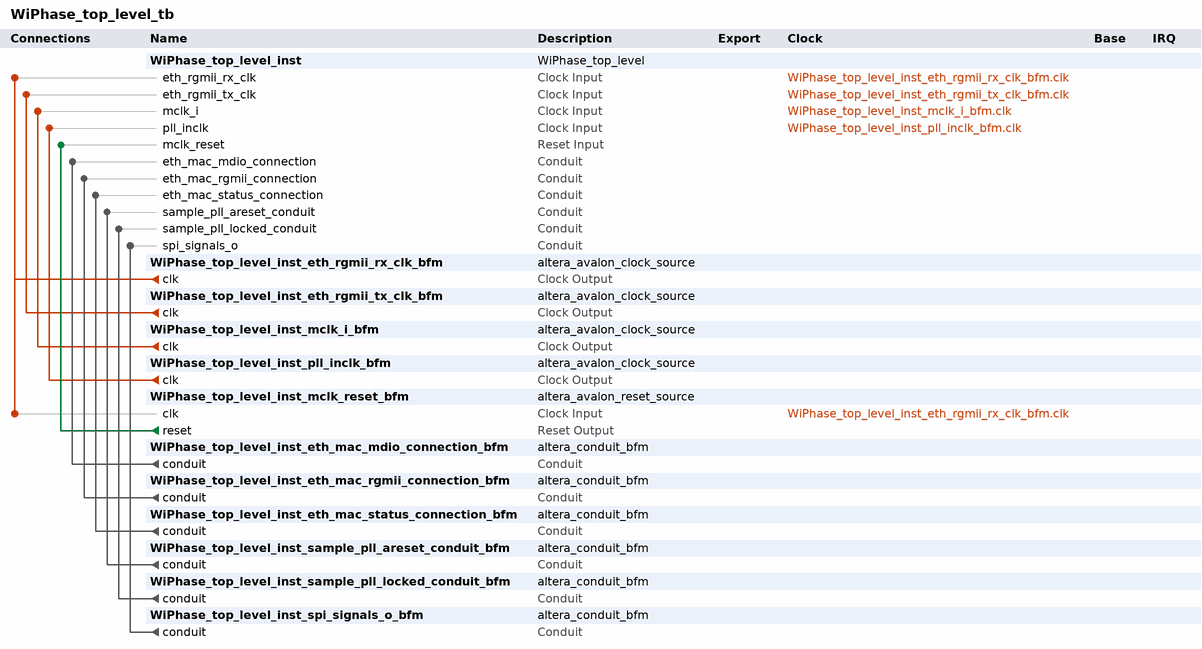
[diagram p0: system contents]
# Platform Designer (Qsys) system WiPhase_top_level_tb, Cyclone 10 LP 10CL025YU256C8G
# Parameters at their usual value, and those the tool derives, are not listed.
package require -exact qsys 17.1
create_system WiPhase_top_level_tb
set_project_property DEVICE_FAMILY {Cyclone 10 LP}
set_project_property DEVICE 10CL025YU256C8G

add_instance WiPhase_top_level_inst WiPhase_top_level 1.0

add_instance WiPhase_top_level_inst_eth_rgmii_rx_clk_bfm altera_avalon_clock_source 17.1

add_instance WiPhase_top_level_inst_eth_rgmii_tx_clk_bfm altera_avalon_clock_source 17.1

add_instance WiPhase_top_level_inst_mclk_i_bfm altera_avalon_clock_source 17.1

add_instance WiPhase_top_level_inst_pll_inclk_bfm altera_avalon_clock_source 17.1

add_instance WiPhase_top_level_inst_mclk_reset_bfm altera_avalon_reset_source 17.1
set_instance_parameter_value WiPhase_top_level_inst_mclk_reset_bfm ASSERT_HIGH_RESET 0
set_instance_parameter_value WiPhase_top_level_inst_mclk_reset_bfm INITIAL_RESET_CYCLES 50

add_instance WiPhase_top_level_inst_eth_mac_mdio_connection_bfm altera_conduit_bfm 17.1
set_instance_parameter_value WiPhase_top_level_inst_eth_mac_mdio_connection_bfm CLOCKED_SIGNAL false
set_instance_parameter_value WiPhase_top_level_inst_eth_mac_mdio_connection_bfm ENABLE_RESET false
set_instance_parameter_value WiPhase_top_level_inst_eth_mac_mdio_connection_bfm SIGNAL_DIRECTIONS input,output,input,input
set_instance_parameter_value WiPhase_top_level_inst_eth_mac_mdio_connection_bfm SIGNAL_ROLES mdc,mdio_in,mdio_oen,mdio_out
set_instance_parameter_value WiPhase_top_level_inst_eth_mac_mdio_connection_bfm SIGNAL_WIDTHS 1,1,1,1

add_instance WiPhase_top_level_inst_eth_mac_rgmii_connection_bfm altera_conduit_bfm 17.1
set_instance_parameter_value WiPhase_top_level_inst_eth_mac_rgmii_connection_bfm CLOCKED_SIGNAL false
set_instance_parameter_value WiPhase_top_level_inst_eth_mac_rgmii_connection_bfm ENABLE_RESET false
set_instance_parameter_value WiPhase_top_level_inst_eth_mac_rgmii_connection_bfm SIGNAL_DIRECTIONS output,input,output,input
set_instance_parameter_value WiPhase_top_level_inst_eth_mac_rgmii_connection_bfm SIGNAL_ROLES rgmii_in,rgmii_out,rx_control,tx_control
set_instance_parameter_value WiPhase_top_level_inst_eth_mac_rgmii_connection_bfm SIGNAL_WIDTHS 4,4,1,1

add_instance WiPhase_top_level_inst_eth_mac_status_connection_bfm altera_conduit_bfm 17.1
set_instance_parameter_value WiPhase_top_level_inst_eth_mac_status_connection_bfm CLOCKED_SIGNAL false
set_instance_parameter_value WiPhase_top_level_inst_eth_mac_status_connection_bfm ENABLE_RESET false
set_instance_parameter_value WiPhase_top_level_inst_eth_mac_status_connection_bfm SIGNAL_DIRECTIONS input,input,output,output
set_instance_parameter_value WiPhase_top_level_inst_eth_mac_status_connection_bfm SIGNAL_ROLES ena_10,eth_mode,set_10,set_1000
set_instance_parameter_value WiPhase_top_level_inst_eth_mac_status_connection_bfm SIGNAL_WIDTHS 1,1,1,1

add_instance WiPhase_top_level_inst_sample_pll_areset_conduit_bfm altera_conduit_bfm 17.1
set_instance_parameter_value WiPhase_top_level_inst_sample_pll_areset_conduit_bfm CLOCKED_SIGNAL false
set_instance_parameter_value WiPhase_top_level_inst_sample_pll_areset_conduit_bfm ENABLE_RESET false
set_instance_parameter_value WiPhase_top_level_inst_sample_pll_areset_conduit_bfm SIGNAL_DIRECTIONS output
set_instance_parameter_value WiPhase_top_level_inst_sample_pll_areset_conduit_bfm SIGNAL_WIDTHS 1

add_instance WiPhase_top_level_inst_sample_pll_locked_conduit_bfm altera_conduit_bfm 17.1
set_instance_parameter_value WiPhase_top_level_inst_sample_pll_locked_conduit_bfm CLOCKED_SIGNAL false
set_instance_parameter_value WiPhase_top_level_inst_sample_pll_locked_conduit_bfm ENABLE_RESET false
set_instance_parameter_value WiPhase_top_level_inst_sample_pll_locked_conduit_bfm SIGNAL_DIRECTIONS input
set_instance_parameter_value WiPhase_top_level_inst_sample_pll_locked_conduit_bfm SIGNAL_WIDTHS 1

add_instance WiPhase_top_level_inst_spi_signals_o_bfm altera_conduit_bfm 17.1
set_instance_parameter_value WiPhase_top_level_inst_spi_signals_o_bfm CLOCKED_SIGNAL false
set_instance_parameter_value WiPhase_top_level_inst_spi_signals_o_bfm ENABLE_RESET false
set_instance_parameter_value WiPhase_top_level_inst_spi_signals_o_bfm SIGNAL_DIRECTIONS output,input,input,input
set_instance_parameter_value WiPhase_top_level_inst_spi_signals_o_bfm SIGNAL_ROLES MISO,MOSI,SCLK,SS_n
set_instance_parameter_value WiPhase_top_level_inst_spi_signals_o_bfm SIGNAL_WIDTHS 1,1,1,3

# connections
add_connection WiPhase_top_level_inst_eth_rgmii_rx_clk_bfm.clk WiPhase_top_level_inst.eth_rgmii_rx_clk clock
add_connection WiPhase_top_level_inst_eth_rgmii_rx_clk_bfm.clk WiPhase_top_level_inst_mclk_reset_bfm.clk clock
add_connection WiPhase_top_level_inst_eth_rgmii_tx_clk_bfm.clk WiPhase_top_level_inst.eth_rgmii_tx_clk clock
add_connection WiPhase_top_level_inst_mclk_i_bfm.clk WiPhase_top_level_inst.mclk_i clock
add_connection WiPhase_top_level_inst_pll_inclk_bfm.clk WiPhase_top_level_inst.pll_inclk clock
add_connection WiPhase_top_level_inst_mclk_reset_bfm.reset WiPhase_top_level_inst.mclk_reset reset
add_connection WiPhase_top_level_inst_eth_mac_mdio_connection_bfm.conduit WiPhase_top_level_inst.eth_mac_mdio_connection conduit
add_connection WiPhase_top_level_inst_eth_mac_rgmii_connection_bfm.conduit WiPhase_top_level_inst.eth_mac_rgmii_connection conduit
add_connection WiPhase_top_level_inst_eth_mac_status_connection_bfm.conduit WiPhase_top_level_inst.eth_mac_status_connection conduit
add_connection WiPhase_top_level_inst_sample_pll_areset_conduit_bfm.conduit WiPhase_top_level_inst.sample_pll_areset_conduit conduit
add_connection WiPhase_top_level_inst_sample_pll_locked_conduit_bfm.conduit WiPhase_top_level_inst.sample_pll_locked_conduit conduit
add_connection WiPhase_top_level_inst_spi_signals_o_bfm.conduit WiPhase_top_level_inst.spi_signals_o conduit

set_interconnect_requirement {$system} qsys_mm.clockCrossingAdapter HANDSHAKE
set_interconnect_requirement {$system} qsys_mm.enableEccProtection FALSE
set_interconnect_requirement {$system} qsys_mm.insertDefaultSlave FALSE
set_interconnect_requirement {$system} qsys_mm.maxAdditionalLatency 1

save_system WiPhase_top_level_tb.qsys
